# Altium schematic sheet schema.SchDoc
size A3
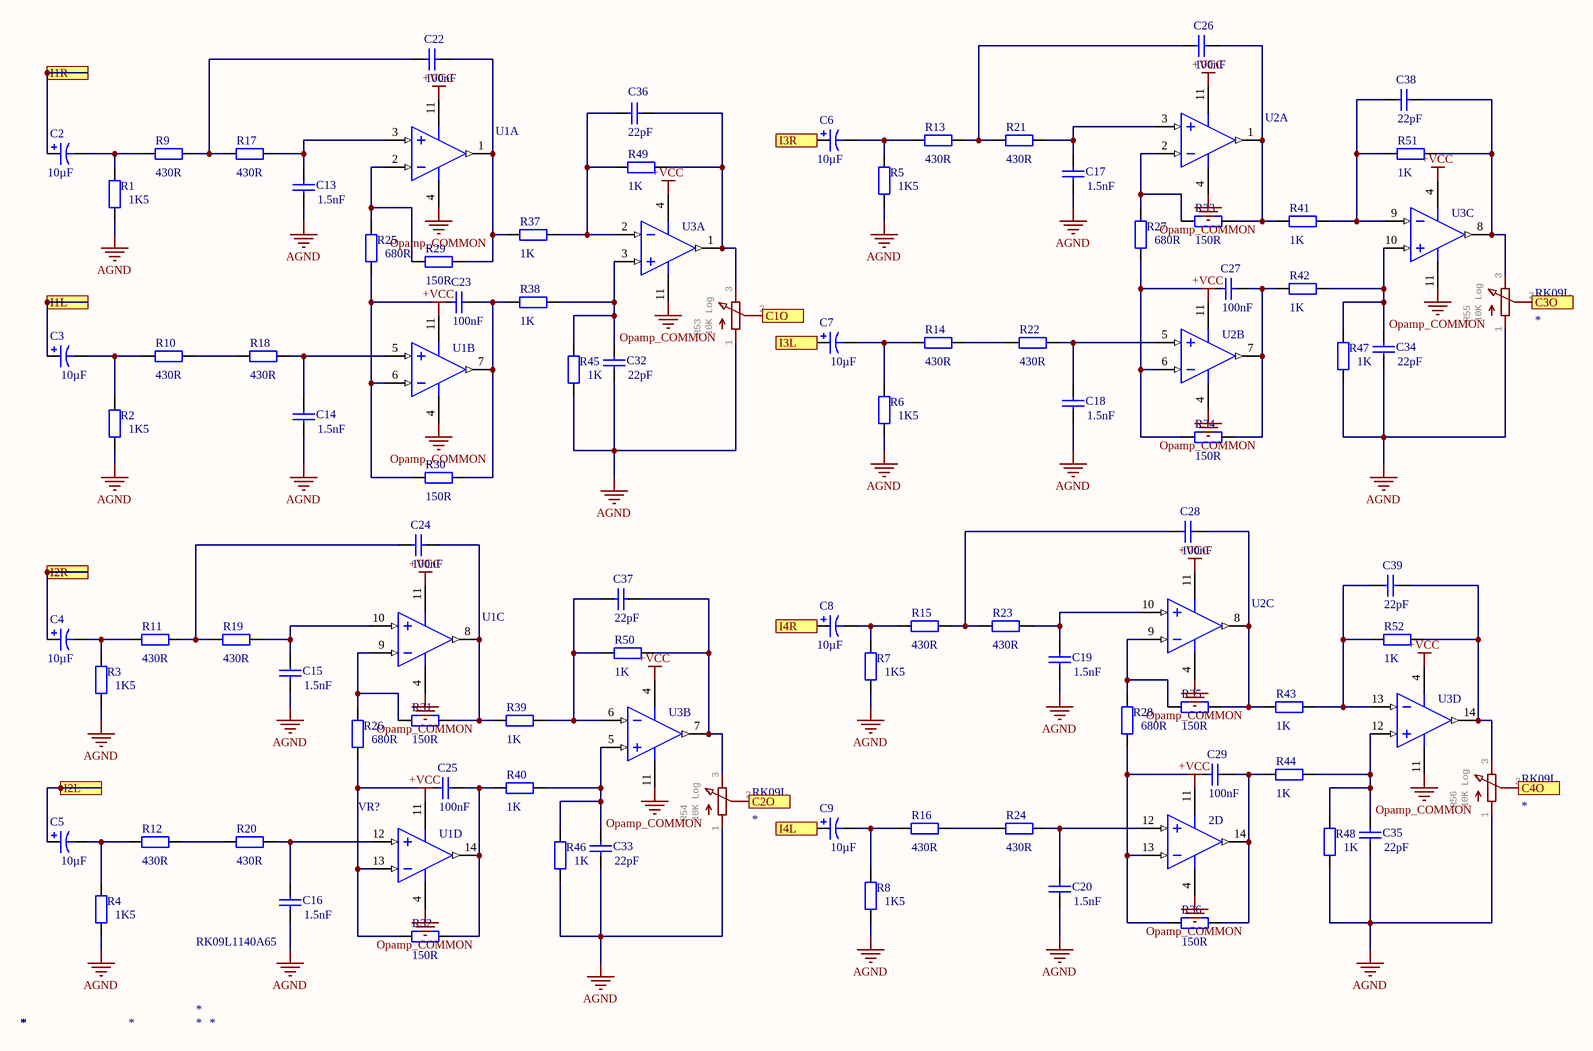
[diagram p0: schema.SchDoc]

## Parts
2  OPA1664AIDR  [OPA1664AIDR]  (value not drawn)  (part D of 4)
C2  value 10µF  [SMD_POLAR_CAPACITOR]  (hidden comment: Cap Pol1)
C3  value 10µF  [SMD_POLAR_CAPACITOR]  (hidden comment: Cap Pol1)
C4  value 10µF  [SMD_POLAR_CAPACITOR]  (hidden comment: Cap Pol1)
C5  value 10µF  [SMD_POLAR_CAPACITOR]  (hidden comment: Cap Pol1)
C6  value 10µF  [SMD_POLAR_CAPACITOR]  (hidden comment: Cap Pol1)
C7  value 10µF  [SMD_POLAR_CAPACITOR]  (hidden comment: Cap Pol1)
C8  value 10µF  [SMD_POLAR_CAPACITOR]  (hidden comment: Cap Pol1)
C9  value 10µF  [SMD_POLAR_CAPACITOR]  (hidden comment: Cap Pol1)
C13  value 1.5nF  [SMD_CAPACITOR]  (hidden comment: Cap)
C14  value 1.5nF  [SMD_CAPACITOR]  (hidden comment: Cap)
C15  value 1.5nF  [SMD_CAPACITOR]  (hidden comment: Cap)
C16  value 1.5nF  [SMD_CAPACITOR]  (hidden comment: Cap)
C17  value 1.5nF  [SMD_CAPACITOR]  (hidden comment: Cap)
C18  value 1.5nF  [SMD_CAPACITOR]  (hidden comment: Cap)
C19  value 1.5nF  [SMD_CAPACITOR]  (hidden comment: Cap)
C20  value 1.5nF  [SMD_CAPACITOR]  (hidden comment: Cap)
C22  value 100nF  [SMD_CAPACITOR]  (hidden comment: Cap)
C23  value 100nF  [SMD_CAPACITOR]  (hidden comment: Cap)
C24  value 100nF  [SMD_CAPACITOR]  (hidden comment: Cap)
C25  value 100nF  [SMD_CAPACITOR]  (hidden comment: Cap)
C26  value 100nF  [SMD_CAPACITOR]  (hidden comment: Cap)
C27  value 100nF  [SMD_CAPACITOR]  (hidden comment: Cap)
C28  value 100nF  [SMD_CAPACITOR]  (hidden comment: Cap)
C29  value 100nF  [SMD_CAPACITOR]  (hidden comment: Cap)
C32  value 22pF  [SMD_CAPACITOR]  (hidden comment: Cap)
C33  value 22pF  [SMD_CAPACITOR]  (hidden comment: Cap)
C34  value 22pF  [SMD_CAPACITOR]  (hidden comment: Cap)
C35  value 22pF  [SMD_CAPACITOR]  (hidden comment: Cap)
C36  value 22pF  [SMD_CAPACITOR]  (hidden comment: Cap)
C37  value 22pF  [SMD_CAPACITOR]  (hidden comment: Cap)
C38  value 22pF  [SMD_CAPACITOR]  (hidden comment: Cap)
C39  value 22pF  [SMD_CAPACITOR]  (hidden comment: Cap)
R1  value 1K5  [SMD_RESISTOR]  (hidden comment: Res2)
R2  value 1K5  [SMD_RESISTOR]  (hidden comment: Res2)
R3  value 1K5  [SMD_RESISTOR]  (hidden comment: Res2)
R4  value 1K5  [SMD_RESISTOR]  (hidden comment: Res2)
R5  value 1K5  [SMD_RESISTOR]  (hidden comment: Res2)
R6  value 1K5  [SMD_RESISTOR]  (hidden comment: Res2)
R7  value 1K5  [SMD_RESISTOR]  (hidden comment: Res2)
R8  value 1K5  [SMD_RESISTOR]  (hidden comment: Res2)
R9  value 430R  [SMD_RESISTOR]  (hidden comment: Res2)
R10  value 430R  [SMD_RESISTOR]  (hidden comment: Res2)
R11  value 430R  [SMD_RESISTOR]  (hidden comment: Res2)
R12  value 430R  [SMD_RESISTOR]  (hidden comment: Res2)
R13  value 430R  [SMD_RESISTOR]  (hidden comment: Res2)
R14  value 430R  [SMD_RESISTOR]  (hidden comment: Res2)
R15  value 430R  [SMD_RESISTOR]  (hidden comment: Res2)
R16  value 430R  [SMD_RESISTOR]  (hidden comment: Res2)
R17  value 430R  [SMD_RESISTOR]  (hidden comment: Res2)
R18  value 430R  [SMD_RESISTOR]  (hidden comment: Res2)
R19  value 430R  [SMD_RESISTOR]  (hidden comment: Res2)
R20  value 430R  [SMD_RESISTOR]  (hidden comment: Res2)
R21  value 430R  [SMD_RESISTOR]  (hidden comment: Res2)
R22  value 430R  [SMD_RESISTOR]  (hidden comment: Res2)
R23  value 430R  [SMD_RESISTOR]  (hidden comment: Res2)
R24  value 430R  [SMD_RESISTOR]  (hidden comment: Res2)
R25  value 680R  [SMD_RESISTOR]  (hidden comment: Res2)
R26  value 680R  [SMD_RESISTOR]  (hidden comment: Res2)
R27  value 680R  [SMD_RESISTOR]  (hidden comment: Res2)
R28  value 680R  [SMD_RESISTOR]  (hidden comment: Res2)
R29  value 150R  [SMD_RESISTOR]  (hidden comment: Res2)
R30  value 150R  [SMD_RESISTOR]  (hidden comment: Res2)
R31  value 150R  [SMD_RESISTOR]  (hidden comment: Res2)
R32  value 150R  [SMD_RESISTOR]  (hidden comment: Res2)
R33  value 150R  [SMD_RESISTOR]  (hidden comment: Res2)
R34  value 150R  [SMD_RESISTOR]  (hidden comment: Res2)
R35  value 150R  [SMD_RESISTOR]  (hidden comment: Res2)
R36  value 150R  [SMD_RESISTOR]  (hidden comment: Res2)
R37  value 1K  [SMD_RESISTOR]  (hidden comment: Res2)
R38  value 1K  [SMD_RESISTOR]  (hidden comment: Res2)
R39  value 1K  [SMD_RESISTOR]  (hidden comment: Res2)
R40  value 1K  [SMD_RESISTOR]  (hidden comment: Res2)
R41  value 1K  [SMD_RESISTOR]  (hidden comment: Res2)
R42  value 1K  [SMD_RESISTOR]  (hidden comment: Res2)
R43  value 1K  [SMD_RESISTOR]  (hidden comment: Res2)
R44  value 1K  [SMD_RESISTOR]  (hidden comment: Res2)
R45  value 1K  [SMD_RESISTOR]  (hidden comment: Res2)
R46  value 1K  [SMD_RESISTOR]  (hidden comment: Res2)
R47  value 1K  [SMD_RESISTOR]  (hidden comment: Res2)
R48  value 1K  [SMD_RESISTOR]  (hidden comment: Res2)
R49  value 1K  [SMD_RESISTOR]  (hidden comment: Res2)
R50  value 1K  [SMD_RESISTOR]  (hidden comment: Res2)
R51  value 1K  [SMD_RESISTOR]  (hidden comment: Res2)
R52  value 1K  [SMD_RESISTOR]  (hidden comment: Res2)
R53  value 10K Log  [RK09L1140A65]
R54  value 10K Log  [RK09L1140A65]
R55  value 10K Log  [RK09L1140A65]
R56  value 10K Log  [RK09L1140A65]
U1  OPA1664AIDR  [OPA1664AIDR]  (value not drawn)  (parts A,B,C,D of 4)
U2  OPA1664AIDR  [OPA1664AIDR]  (value not drawn)  (parts A,B,C of 4)
U3  OPA1664AIDR  [OPA1664AIDR]  (value not drawn)  (parts A,B,C,D of 4)
VR?  RK09L1140A65  [RK09L1140A65]

## Ports
C1O (out), C2O (out), C3O (out), C4O (out), I1L, I1R, I2L, I2R, I3L, I3R, I4L, I4R

## Nets
+VCC: 2.11(V-) U1.11(V-) U2.11(V-) U3.4(V+)
AGND: C13.1 C14.1 C15.1 C16.1 C17.1 C18.1 C19.1 C20.1 C32.1 C33.1 C34.1 C35.1 R1.1 R2.1 R3.1 R4.1 R5.1 R6.1 R7.1 R8.1 R45.1 R46.1 R47.1 R48.1 R53.1 R54.1 R55.1 R56.1
Opamp_COMMON: 2.4(V+) U1.4(V+) U2.4(V+) U3.11(V-)
C1O: R53.2 ; port C1O
C2O: R54.2 ; port C2O
C3O: R55.2 ; port C3O
C4O: R56.2 ; port C4O
I1L: C3.1 ; port I1L
I1R: C2.1 ; port I1R
I2L: C5.1 ; port I2L
I2R: C4.1 ; port I2R
I3L: C7.1 ; port I3L
I3R: C6.1 ; port I3R
I4L: C9.1 ; port I4L
I4R: C8.1 ; port I4R
Net2_12: 2.12(IN_D+) C20.2 R24.2
Net2_13: 2.13(IN_D-) C29.1 R28.1 R36.1
Net2_14: 2.14(OUT_D) C29.2 R36.2 R44.1
NetC2_2: C2.2 R1.2 R9.1
NetC3_2: C3.2 R2.2 R10.1
NetC4_2: C4.2 R3.2 R11.1
NetC5_2: C5.2 R4.2 R12.1
NetC6_2: C6.2 R5.2 R13.1
NetC7_2: C7.2 R6.2 R14.1
NetC8_2: C8.2 R7.2 R15.1
NetC9_2: C9.2 R8.2 R16.1
NetC13_2: C13.2 R17.2 U1.3(IN_A+)
NetC14_2: C14.2 R18.2 U1.5(IN_B+)
NetC15_2: C15.2 R19.2 U1.10(IN_C+)
NetC16_2: C16.2 R20.2 U1.12(IN_D+)
NetC17_2: C17.2 R21.2 U2.3(IN_A+)
NetC18_2: C18.2 R22.2 U2.5(IN_B+)
NetC19_2: C19.2 R23.2 U2.10(IN_C+)
NetC22_1: C22.1 R9.2 R17.1
NetC22_2: C22.2 R29.2 R37.1 U1.1(OUT_A)
NetC23_1: C23.1 R25.1 R30.1 U1.6(IN_B-)
NetC23_2: C23.2 R30.2 R38.1 U1.7(OUT_B)
NetC24_1: C24.1 R11.2 R19.1
NetC24_2: C24.2 R31.2 R39.1 U1.8(OUT_C)
NetC25_1: C25.1 R26.1 R32.1 U1.13(IN_D-)
NetC25_2: C25.2 R32.2 R40.1 U1.14(OUT_D)
NetC26_1: C26.1 R13.2 R21.1
NetC26_2: C26.2 R33.2 R41.1 U2.1(OUT_A)
NetC27_1: C27.1 R27.1 R34.1 U2.6(IN_B-)
NetC27_2: C27.2 R34.2 R42.1 U2.7(OUT_B)
NetC28_1: C28.1 R15.2 R23.1
NetC28_2: C28.2 R35.2 R43.1 U2.8(OUT_C)
NetC32_2: C32.2 R38.2 R45.2 U3.3(IN_A+)
NetC33_2: C33.2 R40.2 R46.2 U3.5(IN_B+)
NetC34_2: C34.2 R42.2 R47.2 U3.10(IN_C+)
NetC35_2: C35.2 R44.2 R48.2 U3.12(IN_D+)
NetC36_1: C36.1 R37.2 R49.1 U3.2(IN_A-)
NetC36_2: C36.2 R49.2 R53.3 U3.1(OUT_A)
NetC37_1: C37.1 R39.2 R50.1 U3.6(IN_B-)
NetC37_2: C37.2 R50.2 R54.3 U3.7(OUT_B)
NetC38_1: C38.1 R41.2 R51.1 U3.9(IN_C-)
NetC38_2: C38.2 R51.2 R55.3 U3.8(OUT_C)
NetC39_1: C39.1 R43.2 R52.1 U3.13(IN_D-)
NetC39_2: C39.2 R52.2 R56.3 U3.14(OUT_D)
NetR10_2: R10.2 R18.1
NetR12_2: R12.2 R20.1
NetR14_2: R14.2 R22.1
NetR16_2: R16.2 R24.1
NetR25_2: R25.2 R29.1 U1.2(IN_A-)
NetR26_2: R26.2 R31.1 U1.9(IN_C-)
NetR27_2: R27.2 R33.1 U2.2(IN_A-)
NetR28_2: R28.2 R35.1 U2.9(IN_C-)

## Library data of the parts
2 U1-U3 = CMP-0272-00211-3: Sound Plus Low-Power, Low-Noise and Distortion, Audio Operational Amplifier, 3 to 36 V, -40 to 85 degC, 14-pin SOIC (D14), Green (RoHS & no Sb/Br); Manufacturer: Texas Instruments; Iq per channel(Max)(mA): 1.5; IIB(Max)(pA): 1200000; Offset Drift(Typ)(uV/C): 2; Total Supply Voltage(Max)(+5V is 5, +/-5V is 10): 36; Rating: Catalog; Packing: LARGE T&R; Slew Rate(Typ)(V/us): 17; CMRR(Min)(dB): 106; Total Supply Voltage(Min)(+5V is 5, +/-5V is 10): 3; Sub Family: Audio Operational Amplifier, High Supply Voltage Amplifier (>=30V), Low Noise Amp (<=10nV/rtHz), Precision Amplifier; GBW(Typ)(MHz): 22; Number of Channels: 4; Code_JEDEC: MS-012; PartNumber: OPA1664AIDR; ComponentLink2Description: Datasheet; ComponentLink3URL: http://www.ti.com/lit/ml/mpds177g/mpds177g.pdf; PackageVersion: 4040047-5/M, 06/2011; ComponentLink1Description: Manufacturer URL; DatasheetVersion: SBOS489; Mounting Technology: Surface Mount; Vio (25C)(Max)(mV): 1.5; PackageReference: D0014A; ComponentLink1URL: http://www.ti.com/; ComponentLink2URL: http://www.ti.com/lit/ds/symlink/opa1664.pdf; Eco-Plan: Green (RoHS & no Sb/Br); PackageDescription: 14-Pin Plastic Small Outline, Body 8.65 x 3.9 mm, Pitch 1.27 mm; ComponentLink3Description: Package Specification
C2-C9 = Cap Pol1: Polarized Capacitor (Radial); Published: 8-Jun-2000; LatestRevisionDate: 17-Jul-2002; LatestRevisionNote: Re-released for DXP Platform.; PackageReference: RB7.6-15; Publisher: Altium Limited; PackageDescription: Polarized Capacitor (Radial); 2 Leads
C13-C20 C22-C29 C32-C39 = Cap: Capacitor; Published: 8-Jun-2000; LatestRevisionDate: 17-Jul-2002; LatestRevisionNote: Re-released for DXP Platform.; PackageReference: RAD-0.3; Publisher: Altium Limited; PackageDescription: Radial Cap, Thru-Hole; 2 Leads; 0.3 in Pin Spacing
R1-R52 = Res2: Resistor; Published: 8-Jun-2000; LatestRevisionDate: 17-Jul-2002; LatestRevisionNote: Re-released for DXP Platform.; PackageReference: AXIAL-0.4; Publisher: Altium Limited; PackageDescription: Axial Device, Thru-Hole; 2 Leads; 0.4 in Pin Spacing
R53-R56 = RK09L: GateName_1: G$1; SymbolName_1: POT_EU-; LibraryName: SD_Pots; DeviceSetName: RK09L
VR? = RK09L1140A65: Variable Resistor; Manufacturer_Name: ALPS; Datasheet Link: https://componentsearchengine.com/Datasheets/1/RK09L1140A65.pdf; Height: 35mm; Mouser2 Part Number: 688-RK09L1140A65; Mouser2 Price/Stock: https://www.mouser.com/Search/Refine.aspx?Keyword=688-RK09L1140A65; Manufacturer_Part_Number: RK09L1140A65